# EasyEDA Pro project PrototypeBoardV1C.eprj

# Schematic Schematic1
Board Name: Board1; Create Date: 2025-06-25; Page Name: P1; Project Name: PrototypeBoardV1C; Schematic Name: Schematic1; Update Date: 2025-08-12; Company: m039; Drawn: Dmitry Mozgin; Page Size: A4; Version: V1.0
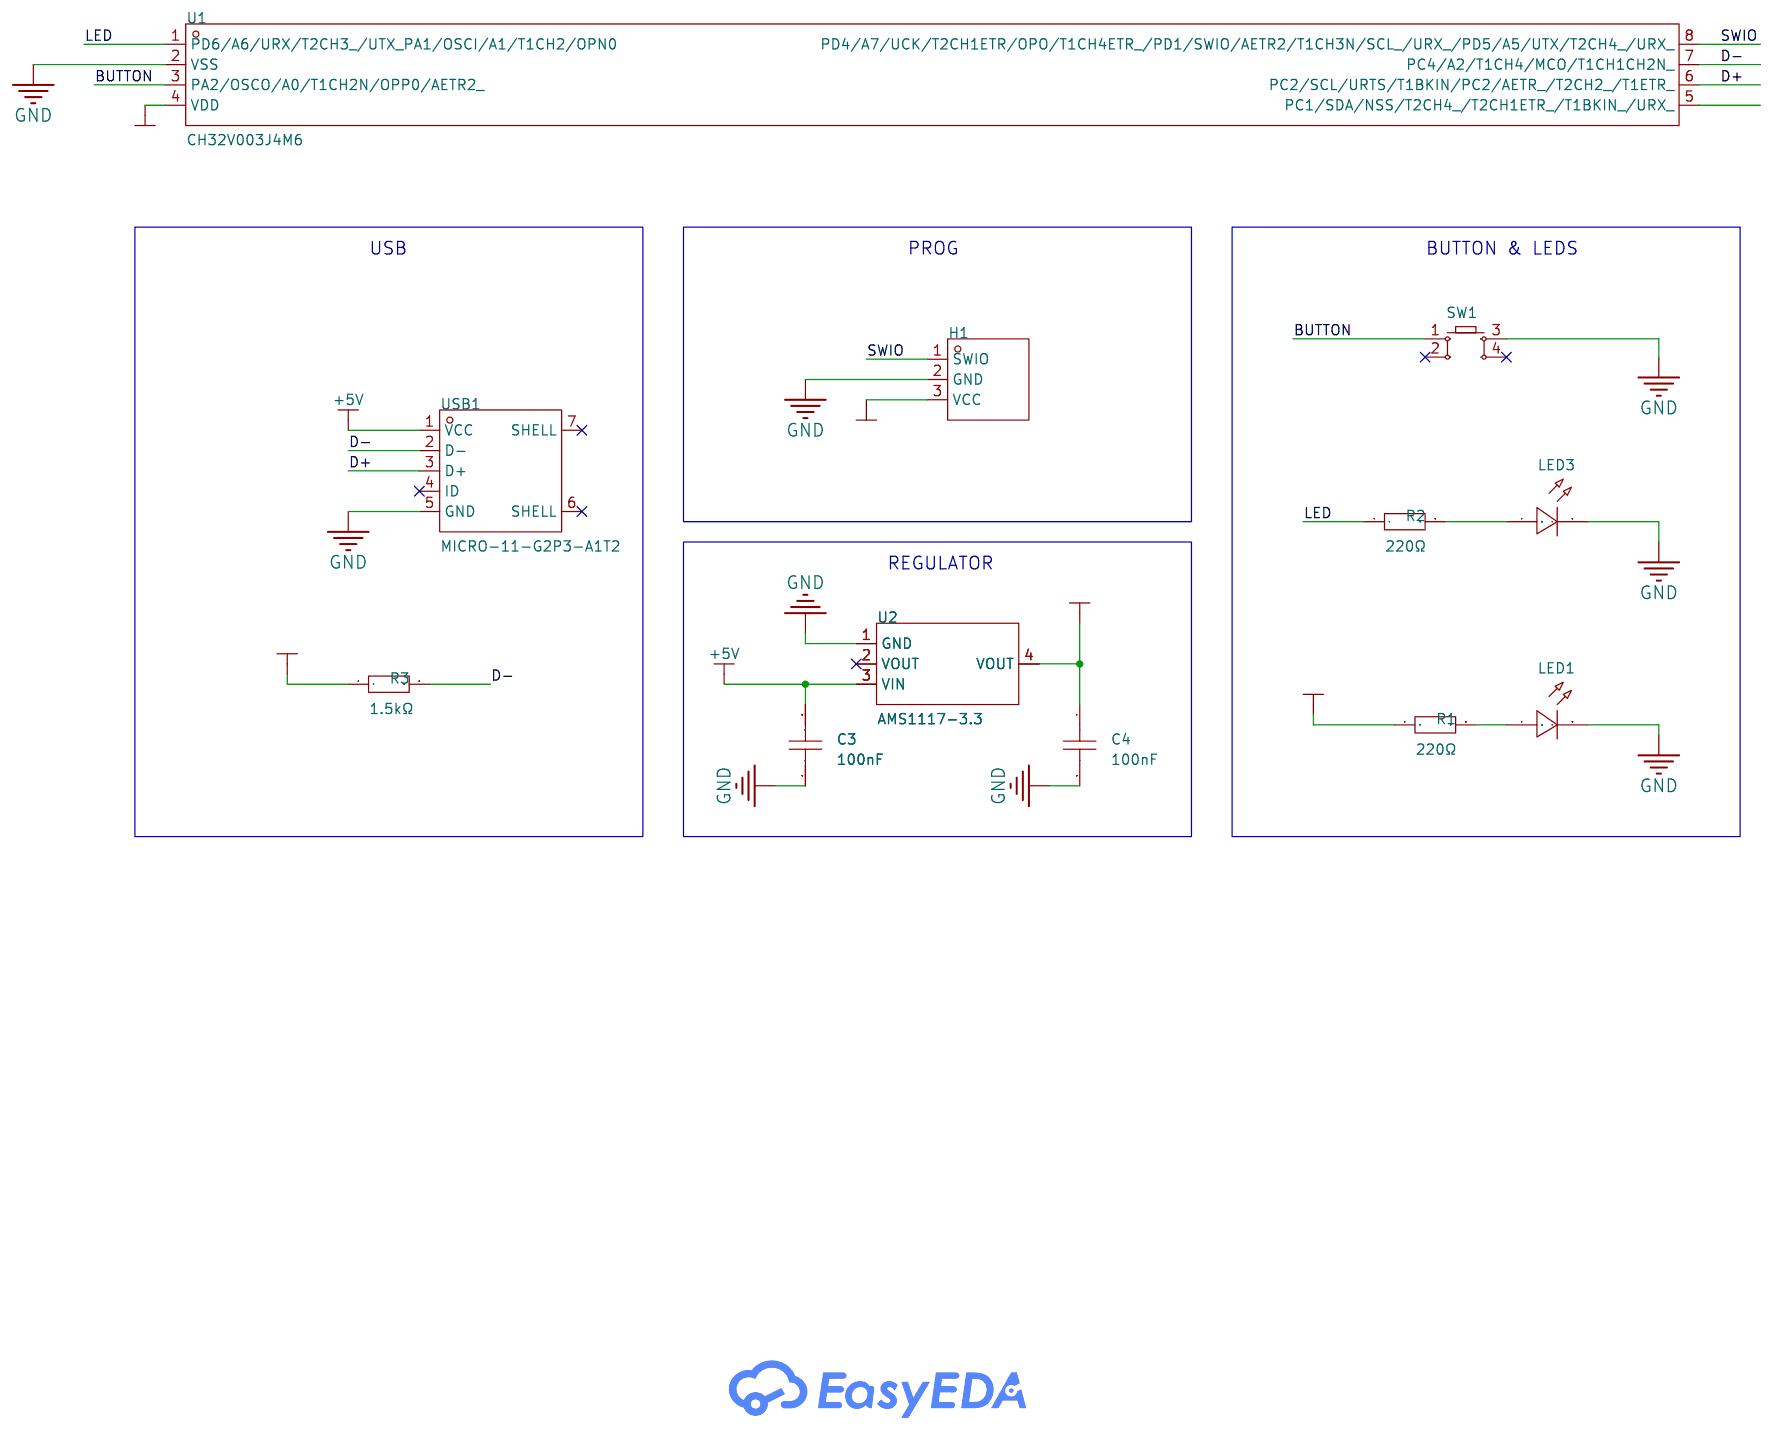
[diagram p0: schematic sheet]

## Parts
C3  100nF  [CAP-TH_L5.8-W3.0-P4.7-D0.45]
C4  100nF  [CAP-TH_L5.8-W3.0-P4.7-D0.45]
H1  -  [HDR-TH_3P-P2.54-V-M]
LED1  -  [LED-TH_BD3.0-P2.54-FD]
LED3  -  [LED-TH_BD3.8-P2.54-FD_BLUE]
R1  220Ω  [RES-TH_BD1.8-L3.2-P7.20-D0.4]
R2  220Ω  [RES-TH_BD1.8-L3.2-P7.20-D0.4]
R3  1.5kΩ  [RES-TH_BD1.8-L3.2-P7.20-D0.4]
SW1  -  [KEY-TH_4P-L6.0-W6.0-P3.90-LS6.5]
U1  CH32V003J4M6  [SOP-8_L4.9-W3.8-P1.27-LS6.0-BL]
U2  AMS1117-3.3  [SOT-223-3_L6.5-W3.4-P2.30-LS7.0-BR]
USB1  MICRO-11-G2P3-A1T2  [MICRO-USB-SMD_MICRO-12-G2P3-A1T2]

## Library data of the parts
C3 C4 = 1C10Z5U104M050B: LCSC Part Name: 100nF ±20% 50V; Supplier Part: C3009699; Manufacturer: VISHAY(威世); Supplier Footprint: 插件,P=10mm; JLCPCB Part Class: Extended Part; Datasheet: https://atta.szlcsc.com/upload/public/pdf/source/20210701/0CF1A7AD3406E72B391D35880AF61B15.pdf; Supplier: LCSC; Tolerance: ±20%; Voltage Rating: 50V; Pin Spacing: 2.54mm; Temperature Coefficient: Z5U; Diameter: 5.08mm; Body Thickness: 3.18mm
H1 = HDR-M_2.54_1x3P: Supplier Footprint: Through
LED1 = LED_TH-R_3mm: Supplier Footprint: Through
LED3 = LED_TH-B_3mm: Supplier Footprint: Through
R1-R3 = Res_AXIAL-1/8W: Supplier Footprint: Through
SW1 = Key_TH_6x6x4.5: Supplier Footprint: Through
U1 = CH32V003J4M6_C5346354: Supplier Part: C5346354; Manufacturer: WCH(南京沁恒); Supplier Footprint: SOP-8; JLCPCB Part Class: Extended Part; Datasheet: https://atta.szlcsc.com/upload/public/pdf/source/20240313/8FAFD0DE100342130E64AE37B01CD8FD.pdf; Supplier: LCSC
U2 = AMS1117-3.3_C6186: LCSC Part Name: 输出3.3V 1A; Supplier Part: C6186; Manufacturer: AMS; Supplier Footprint: SOT-223; JLCPCB Part Class: Basic Part; Datasheet: https://atta.szlcsc.com/upload/public/pdf/source/20180727/C6186_7A095716F0823C02F1997A905E26C086.pdf; Supplier: LCSC; Output Type: Fixed; Voltage - Supply: 16V; Output Voltage: 3.3V; Output Current: 1A; Power Supply Rejection Ratio (PSRR): 72dB@(120Hz); Voltage Dropout: 1.1V@(800mA); standby current: 5mA; Features: Over Current Protection；Over Temperature Protection; Operating Temperature: -40℃~+125℃; Output Configuration: Positive; Number of Outputs: 1
USB1 = MICRO-11-G2P3-A1T2: LCSC Part Name: Micro-B 母 卧贴; Supplier Part: C2874591; Manufacturer: Yuandi(元迪); Supplier Footprint: SMD; JLCPCB Part Class: Extended Part; Datasheet: https://atta.szlcsc.com/upload/public/pdf/source/20210810/D0C2C8ADB80FF6833070AD61CF1472C2.pdf; Supplier: LCSC; Connector Type: Micro-B; Standard: USB 2.0; Gender: Female; Number of Ports: 1; Number of Contacts: 5P; Mounting Style: 卧贴; Current Rating - Power (Max): 1A

## Nets
+3.3V: C4.1 H1.3(VCC) R1.1 R3.1 U1.4(VDD) U2.4(VOUT)
+5V: C3.2 U2.3(VIN) USB1.1(VCC)
GND: C3.1 C4.2 H1.2(GND) LED1.2(A) LED3.2(A) SW1.3 U1.2(VSS) U2.1(GND) USB1.5(GND)
BUTTON: SW1.1 U1.3(PA2/OSCO/A0/T1CH2N/OPP0/AETR2_)
D+: U1.6(PC2/SCL/URTS/T1BKIN/PC2/AETR_/T2CH2_/T1ETR_) USB1.3(D+)
D-: R3.2 U1.7(PC4/A2/T1CH4/MCO/T1CH1CH2N_) USB1.2(D-)
LED: R2.1 U1.1(PD6/A6/URX/T2CH3_/UTX_PA1/OSCI/A1/T1CH2/OPN0)
SWIO: H1.1(SWIO) U1.8(PD4/A7/UCK/T2CH1ETR/OPO/T1CH4ETR_/PD1/SWIO/AETR2/T1CH3N/SCL_/URX_/PD5/A5/UTX/T2CH4_/URX_)
$1N1276: LED1.1(C) R1.2
$1N2333: LED3.1(C) R2.2

Not connected (* = marked no-connect by the designer): SW1 2* 4*; U1 5(PC1/SDA/NSS/T2CH4_/T2CH1ETR_/T1BKIN_/URX_); U2 2(VOUT)*; USB1 4(ID)* 6(SHELL)* 7(SHELL)*

## Notes on the sheet
- USB
- PROG
- BUTTON & LEDS
- REGULATOR

# Board PCB1
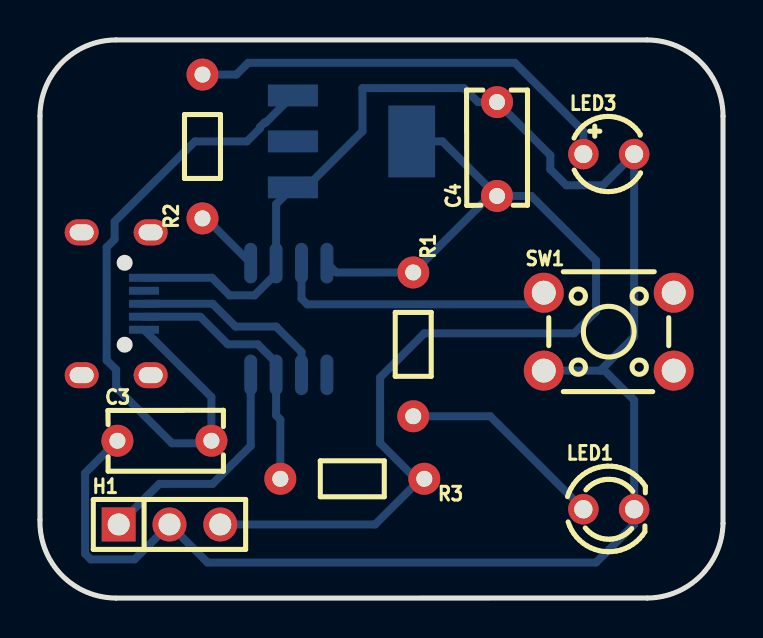
[diagram p1: board, top side]
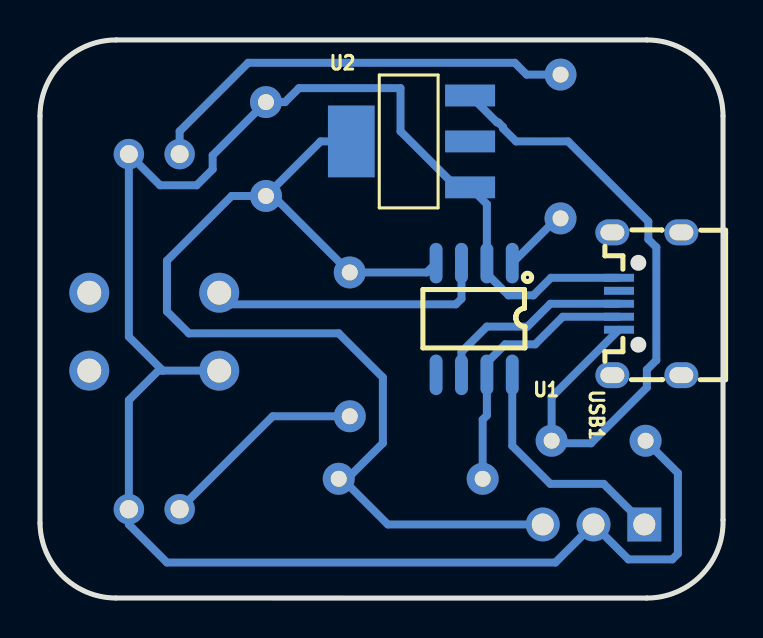
[diagram p2: board, bottom side, seen from below]

Outline 34.16 x 27.94 mm; copper layers: Top Layer, Bottom Layer. Coordinates in mm from the lower left corner of the outline.
Outline path: 0,24.13 0,3.92 arc(1.08,1.15) 3.81,0 30.38,0 arc(33.03,1.1) 34.16,3.74 34.16,24.13 arc(33.05,26.82) 30.35,27.94 3.81,27.94 arc(1.12,26.83) 0,24.13
Stack: Top Layer 0.035mm / Dielectric1 1.51mm FR4 er 4.5 / Bottom Layer 0.035mm

## Design rules (mm)
template: Custom Config
spacing copperThickness1oz (default): track to track 0.2, other pairs 0.152 to 0.3
spacing copperThickness2oz: track to track 0.203, other pairs 0.152 to 0.3
track width copperThickness1oz (default): min 0.127, default 0.4, max 2.54
track width copperThickness2oz: min 0.203, default 0.254, max 2.54
differential pair differentialPair (default): width min 0.127, default 0.254, max 2.54; gap min 0.152, default 0.152
via viaSize (default): diameter min 0.5, default 0.61, max 10; hole min 0.3, default 0.305, max 6.3

## Placement (name value [footprint] x y rotation side)
C3  100nF  [CAP-TH_L5.8-W3.0-P4.7-D0.45]  6.22 7.88 0 top
C4  100nF  [CAP-TH_L5.8-W3.0-P4.7-D0.45]  22.86 22.48 90 top
H1  -  [HDR-TH_3P-P2.54-V-M]  6.48 3.68 0 top
LED1  -  [LED-TH_BD3.0-P2.54-FD]  28.45 4.45 0 top
LED3  -  [LED-TH_BD3.8-P2.54-FD_BLUE]  28.45 22.23 0 top
R1  220Ω  [RES-TH_BD1.8-L3.2-P7.20-D0.4]  18.67 12.7 270 top
R2  220Ω  [RES-TH_BD1.8-L3.2-P7.20-D0.4]  8.13 22.61 90 top
R3  1.5kΩ  [RES-TH_BD1.8-L3.2-P7.20-D0.4]  15.62 5.97 180 top
SW1  -  [KEY-TH_4P-L6.0-W6.0-P3.90-LS6.5]  28.45 13.34 0 top
U1  CH32V003J4M6  [SOP-8_L4.9-W3.8-P1.27-LS6.0-BL]  12.45 13.97 0 bottom
U2  AMS1117-3.3  [SOT-223-3_L6.5-W3.4-P2.30-LS7.0-BR]  15.62 22.86 180 bottom
USB1  MICRO-11-G2P3-A1T2  [MICRO-USB-SMD_MICRO-12-G2P3-A1T2]  3.81 14.73 90 bottom

## Footprints (pads in the part's own frame, mm; a bottom-side part is the same pattern mirrored in y, then rotated)
CAP-TH_L5.8-W3.0-P4.7-D0.45
  round 1.6 hole 0.8: 1(-2.35,0) 2(2.35,0)
HDR-TH_3P-P2.54-V-M
  rect 1.7x1.7 hole 1.1: 1(-2.54,0)
  round 1.7 hole 1.1: 2(0,0) 3(2.54,0)
KEY-TH_4P-L6.0-W6.0-P3.90-LS6.5
  round 2 hole 1.2: 1(-3.25,1.95) 2(3.25,1.95) 3(-3.25,-1.95) 4(3.25,-1.95)
LED-TH_BD3.0-P2.54-FD
  round 1.524 hole 0.914: 1(-1.27,0) 2(1.27,0)
LED-TH_BD3.8-P2.54-FD_BLUE
  round 1.524 hole 0.9: 1(-1.27,0) 2(1.27,0)
MICRO-USB-SMD_MICRO-12-G2P3-A1T2
  rect 0.4x1.5 smd: 1(-1.3,1.393) 2(-0.65,1.393) 3(0,1.393) 4(0.65,1.393) 5(1.3,1.393)
  oval 1.3x1.7 hole 0.8x1.2: 6(-3.575,-1.725) 6(-3.575,1.725) 7(3.575,-1.725) 7(3.575,1.725)
RES-TH_BD1.8-L3.2-P7.20-D0.4
  round 1.6 hole 0.8: 1(-3.6,0) 2(3.6,0)
SOP-8_L4.9-W3.8-P1.27-LS6.0-BL
  oval 0.65x2.032 smd: 1(-1.905,-2.796) 2(-0.635,-2.796) 3(0.635,-2.796) 4(1.905,-2.796) 5(1.905,2.796) 6(0.635,2.796) 7(-0.635,2.796) 8(-1.905,2.796)
SOT-223-3_L6.5-W3.4-P2.30-LS7.0-BR
  rect 2.5x1.1 smd: 1(2.97,-2.3) 2(2.97,0) 3(2.97,2.3)
  rect 2.34x3.6 smd: 4(-2.97,0)

## Nets
As in the schematic.

Pads without a net: SW1 2 4; U2 2; USB1 4 6 7

## Routing (per net, layer and track width the routed paths; a pad name or vN(x,y) marks a point on that pad's centre or on a via; arc(x,y) is an arc through that point)
+3.3V: length 53.9
  Bottom Layer w0.4: C4.1 22.5,20.13 R1.1 14.82,16.3 U1.4 ; C4.1 24.57,20.13 27.81,16.89 27.81,14.35 26.71,13.25 19.22,13.25 17.01,11.05 17.01,7.75 18.8,5.97 19.05,5.97 ; C4.1 20.13,22.86 U2.4 ; 19.05,5.97 16.76,3.68 H1.3 ; 19.05,5.97 R3.1
+5V: length 33.2
  Bottom Layer w0.4: U2.3 11.3,23.81 11.24,23.81 11,23.58 11,23.51 10.35,22.86 7.75,22.86 3.74,18.85 3.74,17.96 3.34,17.56 3.34,11.91 3.81,11.43 3.81,10.54 6.6,7.75 8.45,7.75 C3.2 8.57,10.06 USB1.1
GND: length 94.7
  Bottom Layer w0.4: 28.02,11.39 28.24,11.39 29.72,9.91 LED1.2 29.72,3.68 27.81,1.78 8.38,1.78 H1.2 4.73,1.94 2.54,1.94 2.26,2.22 2.26,6.26 3.87,7.88 ; 28.02,11.39 SW1.3 ; 28.02,11.39 29.72,13.08 LED3.2 28.16,20.66 26.33,20.66 25.53,21.46 25.53,22.16 C4.2 21.91,24.83 21.21,25.53 16.13,25.53 16.13,23.37 13.32,20.56 U2.1 11.81,19.72 U1.2 11.81,16.24 10.73,15.15 9.49,15.15 8.61,16.03 USB1.5
BUTTON: length 14.3
  Bottom Layer w0.4: SW1.1 24.62,14.7 13.36,14.7 13.08,14.99 U1.3
D+: length 10
  Bottom Layer w0.4: USB1.3 8.64,14.73 9.78,13.59 11.81,13.59 13.08,12.32 U1.6
D-: length 13.5
  Bottom Layer w0.4: USB1.2 8.02,14.08 9.4,12.7 10.9,12.7 11.81,11.79 U1.7 11.81,9.15 12.02,8.94 12.02,5.97
LED: length 3.3
  Bottom Layer w0.4: R2.1 8.3,19.01 U1.1
SWIO: length 11.8
  Bottom Layer w0.4: U1.8 10.54,7.62 8.64,5.72 5.97,5.72 H1.1
$1N1276: length 10.4
  Bottom Layer w0.4: LED1.1 22.52,9.1 R1.2
$1N2333: length 21.9
  Bottom Layer w0.4: R2.2 9.82,26.21 10.41,26.8 23.75,26.8 27.18,23.37 LED3.1
